# EAGLE design SparkFun_LIS3DH-Breakout (EAGLE 7.5.0)
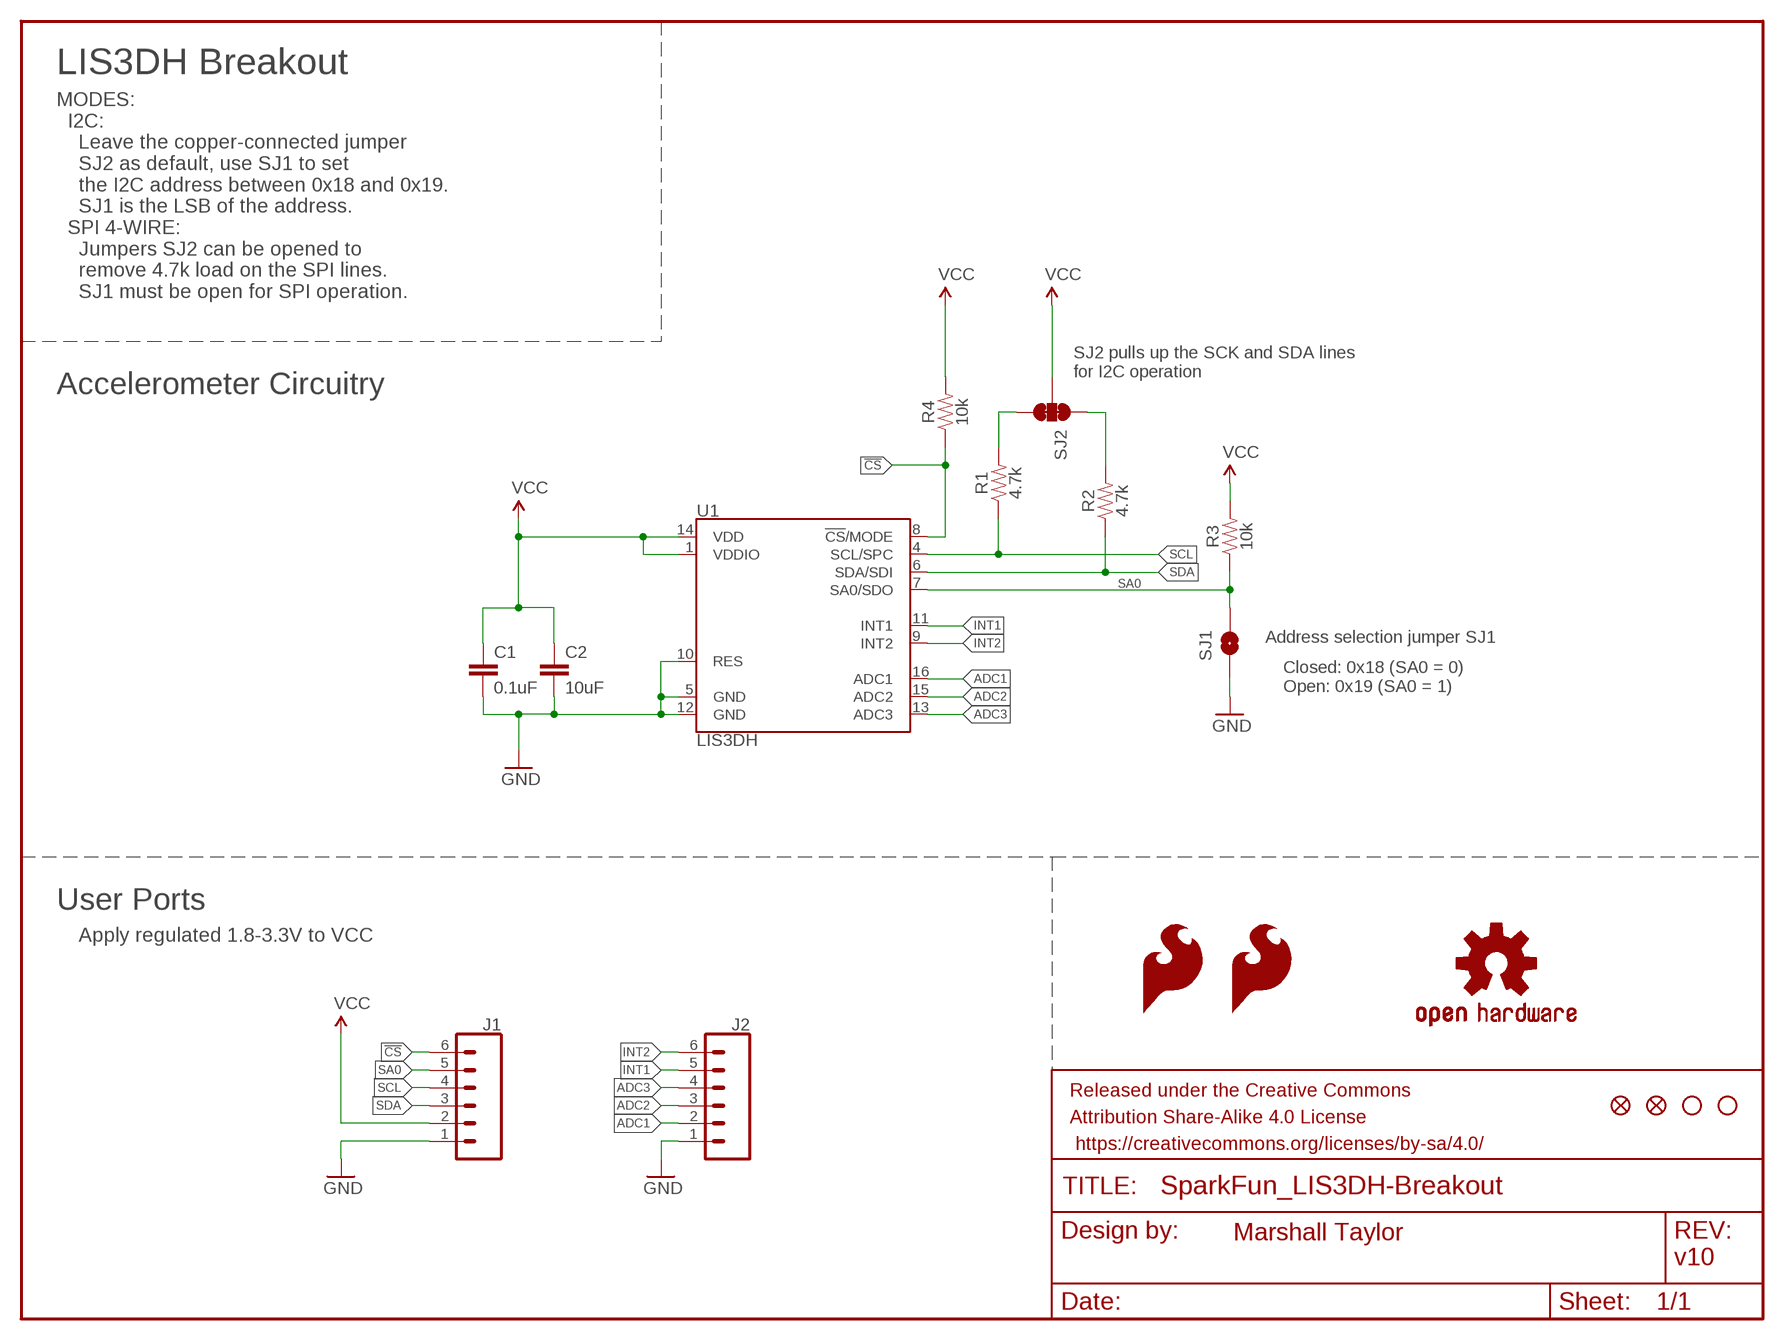
[diagram p0: schematic, sheet 1]

## Parts
C1  0.1uF  0.1UF-0402-16V-10%  [0402]
C2  10uF  10UF-0603-6.3V-20%  [0603]
FRAME2  FRAME-LETTER  [CREATIVE_COMMONS]
J1  CONN_06NO_SILK_FEMALE_PTH  [1X06_NO_SILK]
J2  CONN_06NO_SILK_FEMALE_PTH  [1X06_NO_SILK]
JP2  FIDUCIALUFIDUCIAL  [MICRO-FIDUCIAL]
JP3  STAND-OFF  [STAND-OFF]
JP4  STAND-OFF  [STAND-OFF]
JP6  FIDUCIALUFIDUCIAL  [MICRO-FIDUCIAL]
LOGO1  SFE_LOGO_FLAME.1_INCH  [SFE_LOGO_FLAME_.1]
LOGO2  SFE_LOGO_FLAME.1_INCH  [SFE_LOGO_FLAME_.1]
R1  4.7k  4.7KOHM-0603-1/10W-1%  [0603]
R2  4.7k  4.7KOHM-0603-1/10W-1%  [0603]
R3  10k  10KOHM-0603-1/10W-1%  [0603]
R4  10k  10KOHM-0603-1/10W-1%  [0603]
SJ1  SOLDERJUMPERNO  [SJ_2S-NO]
SJ2  JUMPER-PAD-3-NC_BY_TRACE  [PAD-JUMPER-3-3OF3_NC_BY_TRACE_YES_SILK_FULL_BOX]
U1  LIS3DH  [LGA-16-3X3]
U$1  OSHW-LOGOS  [OSHW-LOGO-S]

## Nets
!CS: J1.6 R4.1 U1.8(!CS!/MODE)
ADC1: J2.2 U1.16(ADC1)
ADC2: J2.3 U1.15(ADC2)
ADC3: J2.4 U1.13(ADC3)
GND: C1.2 C2.2 J1.1 J2.1 SJ1.1 U1.5(GND) U1.10(RES) U1.12(GND)
INT1: J2.5 U1.11(INT1)
INT2: J2.6 U1.9(INT2)
N$1: R2.2 SJ2.1
N$2: R1.2 SJ2.3
SA0: J1.5 R3.1 SJ1.2 U1.7(SA0/SDO)
SCL: J1.4 R1.1 U1.4(SCL/SPC)
SDA: J1.3 R2.1 U1.6(SDA/SDI)
VCC: C1.1 C2.1 J1.2 R3.2 R4.2 SJ2.2 U1.1(VDDIO) U1.14(VDD)

## Notes on the sheet
- LIS3DH Breakout
- MODES:
    I2C:
      Leave the copper-connected jumper
      SJ2 as default, use SJ1 to set
      the I2C address between 0x18 and 0x19.
      SJ1 is the LSB of the address.
    SPI 4-WIRE:
      Jumpers SJ2 can be opened to 
      remove 4.7k load on the SPI lines.
      SJ1 must be open for SPI operation.
- SJ2 pulls up the SCK and SDA lines
  for I2C operation
- Accelerometer Circuitry
- Address selection jumper SJ1
- Closed: 0x18 (SA0 = 0)
  Open: 0x19 (SA0 = 1)
- User Ports
- Apply regulated 1.8-3.3V to VCC
- Marshall Taylor
- v10

## Library data of the parts
C1 = SparkFun-Capacitors:0.1UF: 0.1µF ceramic capacitors A capacitor is a passive two-terminal electrical component used to store electrical energy temporarily in an electric field.; PROD_ID: CAP-12416
C2 = SparkFun-Capacitors:10UF: 10.0µF ceramic capacitors A capacitor is a passive two-terminal electrical component used to store electrical energy temporarily in an electric field.; PROD_ID: CAP-11015
FRAME2 = SparkFun-Aesthetics:FRAME-LETTER: Schematic Frame Standard 8.5x11 US Letter frame
J1 J2 = SparkFun-Connectors:CONN_06: Header 6 Standard 6-pin 0.1" header. Use with straight break away headers (SKU : PRT-00116), right angle break away headers (PRT-00553), swiss pins (PRT-00743), machine pins (PRT-00117), and female headers (PRT-00115). Molex polarized connector foot print use with SKU : PRT-08094 with associated crimp pins and housings. NOTES ON THE VARIANTS LOCK and LOCK_LONGPADS... This footprint was designed to help hold the alignment of a through-hole component (i.e. 6-pin header) while soldering it into place. You may notice that each hole has been shifted either up or down by 0.005 of an inch from it's more standard position (which is a perfectly straight line). This slight alteration caused the pins (the squares in the middle) to touch the edges of the holes. Because they are alternating, it causes a "brace" to hold the component in place. 0.005 has proven to be the perfect amount of "off-center" position when using our standard breakaway headers. Although looks a little odd when you look at the bare footprint, once you have a header in there, the alteration is very hard to notice. Also,if you push a header all the way into place, it is covered up entirely on the bottom side. This idea of altering the position of holes to aid alignment will be further integrated into the Sparkfun Library for other footprints. It can help hold any component with 3 or more connection pins.; PROD_ID: CONN-08437
JP2 JP6 = SparkFun:FIDUCIAL: Fiducial Alignment Points Various fiducial points for machine vision alignment.
JP3 JP4 = SparkFun:STAND-OFF: Stand Off This is the mechanical footprint for a #4 phillips button head screw. Use the keepout ring to avoid running the screw head into surrounding components. SKU : PRT-00447
LOGO1 LOGO2 = SparkFun-Aesthetics:SFE_LOGO_FLAME: SFE Logo, flame only This is the SparkFun flame logo. The logo on the schematic will always be the same size; the package variant is the height of the flame. Default layer for the logo on the board is tSilk.
R1 R2 = SparkFun-Resistors:4.7KOHM: 4.7kΩ resistor A resistor is a passive two-terminal electrical component that implements electrical resistance as a circuit element. Resistors act to reduce current flow, and, at the same time, act to lower voltage levels within circuits.; PROD_ID: RES-07857
R3 R4 = SparkFun-Resistors:10KOHM: 10kΩ resistor A resistor is a passive two-terminal electrical component that implements electrical resistance as a circuit element. Resistors act to reduce current flow, and, at the same time, act to lower voltage levels within circuits.; PROD_ID: RES-00824
SJ1 = SparkFun:SOLDERJUMPER: Solder Jumper Standard SMD solder jumper. Used to automate production. Two varients : Normally Open and Normally Closed are the same, but have different paste layers. NC will have a large amount of paste and should jumper during reflow.
SJ2 = TestAperatures:JUMPER-PAD-3-NC_BY_TRACE
U1 = SparkFun-Sensors:LIS3DH: ST Microelectronics LIS3DH 3-Axis ±2/4/8/16g SPI/I2C Accelerometer The LIS3DH is a three axis MEMS linear accelerometer in the "nano" family. It has a digital I2C/SPI serial interface which makes it ideal for using in embedded applications. The device also features ultra low-power operational modes that allow advanced power saving and smart sleep to wake-up functions, built in detections with interrupts, and auxiliary ADC inputs Datasheet-XXXX <http://www.sparkfun.com/datasheets/Sensors/Accelerometer/LIS3DH.pdf> SparkFun Products SparkFun Triple Axis Accelerometer Breakout - LIS3DH <https://www.sparkfun.com/products/10345> (SEN-XXXXX) Triple Axis Accelerometer - LIS3DH <https://www.sparkfun.com/products/9755> (SEN-XXXXX); PROD_ID: IC-13419; SF_ID: N/A
U$1 = SparkFun:OSHW-LOGO: Open Source Hardware Logo This logo indicates the piece of hardware it is found on incorporates a OSHW license and/or adheres to the definition of open source hardware found here: http://freedomdefined.org/OSHW

## Board
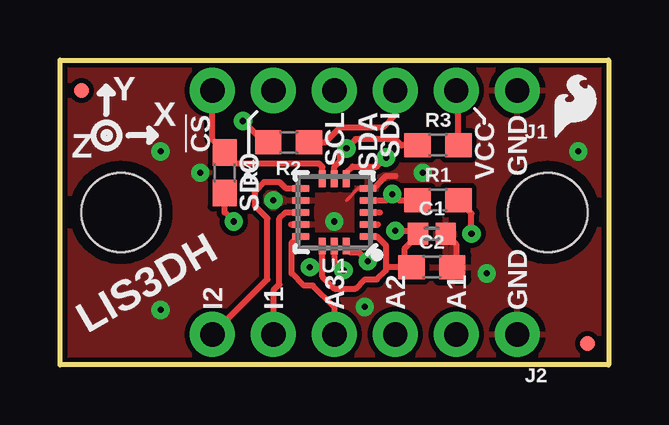
[diagram p1: board, top side]
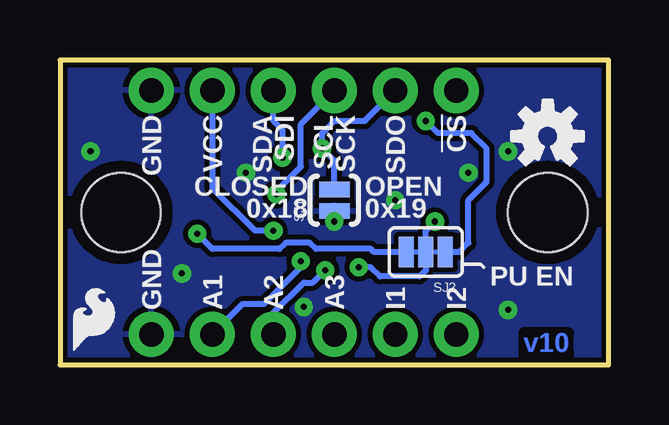
[diagram p2: board, bottom side, seen from below]

Size 22.86 x 12.7 mm. Coordinates in mm from the lower left corner, seen from the top.
Outline: 0,0 0,12.7 22.86,12.7 22.86,0 0,0
Copper layers (1*16): Top 0.035mm / dielectric 1.5mm / Bottom 0.035mm
Design rules "SparkFun-2-layer-FAB-LIMIT *": minimum track width 6mil, minimum drill 6mil, track to track 8mil, track to pad 8mil, pad to pad 8mil, via to via 8mil, smd to smd 4mil, copper to edge 8mil, drill to drill 8mil, minimum pad ring 12mil, minimum via ring 10mil, stop-mask expansion 4mil, vias tented up to drill 25mil, thermal gap 10mil

### Footprints (pad centres in the part's own frame; a part is rotated, then mirrored left to right if it is on the bottom)
0402 = smd 0.85 x 0.9: 1 -0.58,0; 2 0.58,0
0603 = smd 1.1 x 1: 1 -0.85,0; 2 0.85,0
1X06_NO_SILK = drill 1.016 pad 1.88: 1 0,0; 2 2.54,0; 3 5.08,0; 4 7.62,0; 5 10.16,0; 6 12.7,0
MICRO-FIDUCIAL = smd 0.635 x 0.635: 1 0,0
STAND-OFF = hole 3.302: 0,0
SJ_2S-NO = smd 0.635 x 1.27: 1 -0.45,0; 2 0.45,0
PAD-JUMPER-3-3OF3_NC_BY_TRACE_YES_SILK_FULL_BOX = smd 0.635 x 1.27: 1 -0.813,0; 2 0,0; 3 0.813,0
LGA-16-3X3 = smd 0.7 x 0.28: 1 -1.4,1; 2 -1.4,0.5; 3 -1.4,0; 4 -1.4,-0.5; 5 -1.4,-1; 9 1.4,-1; 10 1.4,-0.5; 11 1.4,0; 12 1.4,0.5; 13 1.4,1 | smd 0.28 x 0.7: 6 -0.5,-1.4; 7 0,-1.4; 8 0.5,-1.4; 14 0.5,1.4; 15 0,1.4; 16 -0.5,1.4

### Placement (x,y rotation side)
C1  15.49,5.46 0 top
C2  15.49,4.06 0 top
FRAME2  -20.32,-19.05 0 top  (outside the outline)
J1  19.05,11.43 180 top
J2  19.05,1.27 180 top
JP2  21.97,0.89 0 top
JP3  2.54,6.35 0 top
JP4  20.32,6.35 0 top
JP6  0.89,11.43 0 top
LOGO1  20.32,9.14 0 top
LOGO2  22.61,0.25 0 bottom
R1  15.75,6.86 0 top
R2  9.53,9.27 180 top
R3  15.75,9.14 0 top
R4  6.86,8 270 top
SJ1  11.43,6.86 90 bottom
SJ2  7.62,4.7 180 bottom
U1  11.43,6.35 180 top
U$1  2.54,9.53 0 bottom

### Tracks (layer width: path | path; a pad name or v marks a point on that pad's centre or on a via)
!CS
  Top 0.254: U1.8 10.93,8.25 10.79,8.38 7.33,8.38 R4.1 6.86,8.89 6.35,9.4 J1.6
ADC1  (via drill 0.25 pad 0.25)
  Top 0.254: U1.16 11.93,4.83 12.06,4.7 12.45,4.7 v12.83,4.32
  Bottom 0.254: v12.83,4.32 12.83,4.06 14.35,2.54 15.24,2.54 J2.2
ADC2  (via drill 0.25 pad 0.25)
  Top 0.254: U1.15 11.43,4.32 v11.81,3.94
  Bottom 0.254: v11.81,3.94 12.32,3.43 12.7,3.43 13.97,2.16 J2.3
ADC3
  Top 0.254: U1.13 9.92,5.35 9.65,5.08 9.65,3.81 10.16,3.3 10.54,3.3 11.43,2.41 J2.4
GND  (via drill 0.25 pad 0.25)
  Top 0.152: U1.5 12.43,7.35 11.94,6.86
  Top 0.254: v11.43,5.97 11.43,6.1 | 13.97,7.87 13.59,7.87 13.08,7.37 12.83,7.37 | C2.2 16.51,4.23 16.51,5.03 C1.2
  Bottom 0.254: SJ1.1 v11.43,5.97
  other vias: 17.78,3.81 12.7,2.41 8.89,6.86 5.84,8 4.19,2.29 15.11,8 21.59,8.89 4.19,8.89
  pour Bottom (isolate 0.203): 0,0 0,12.7 22.86,12.7 22.86,0
  pour Top (isolate 0.203): 0,0 0,12.7 22.86,12.7 22.86,0
INT1
  Top 0.254: U1.11 9.4,6.35 9.14,6.1 9.14,3.35 8.89,3.1 J2.5
INT2
  Top 0.254: U1.9 10.01,7.37 9.4,7.37 9.14,7.62 8.51,7.62 8.13,7.24 8.13,6.6 8.64,6.1 8.64,3.56 J2.6
N$1  (via drill 0.25 pad 0.25)
  Top 0.254: R2.2 8.51,9.27 v7.62,10.16
  Bottom 0.254: v7.62,10.16 7.11,9.65 5.71,9.65 5.08,9.02 5.08,7.62 5.84,6.86 5.84,5.08 6.22,4.7 SJ2.1
N$2  (via drill 0.25 pad 0.25)
  Top 0.254: v17.14,5.46 17.14,6.31 R1.2
  Bottom 0.254: SJ2.3 9.78,4.7 9.91,4.83 12.19,4.83 12.45,5.08 13.46,5.08 13.72,4.83 16.51,4.83 v17.14,5.46
N$4
  Top 0.254: 13.08,6.35 13.34,6.35
N$5
  Top 0.254: 13.08,5.84 13.26,5.84
N$6
  Top 0.254: 9.63,5.84 9.88,5.84
SA0  (via drill 0.25 pad 0.25)
  Top 0.254: U1.7 11.43,8.26 11.68,8.51 11.68,8.76 v11.94,9.02 12.32,9.4 13.97,9.4 14.22,9.14 R3.1
  Bottom 0.254: J1.5 10.16,10.16 11.43,10.16 11.94,9.65 v11.94,9.02 11.43,8.51 SJ1.2
SCL  (via drill 0.25 pad 0.25)
  Top 0.254: U1.4 13.58,6.85 v13.84,7.11 14.1,6.86 R1.1
  Bottom 0.254: J1.4 12.83,10.03 12.83,8.26 13.84,7.24 v13.84,7.11
SDA  (via drill 0.25 pad 0.25)
  Top 0.254: U1.6 11.93,7.99 12.19,8.26 13.21,8.26 v13.59,8.64 | R2.1 11.05,9.27 11.68,9.91 13.46,9.91 13.97,10.41 J1.3
  Bottom 0.254: v13.59,8.64 13.59,9.78 13.97,10.16 J1.3
VCC  (via drill 0.25 pad 0.25)
  Top 0.254: 16.51,9.23 R3.2 16.6,11.34 J1.2 | 10.93,3.94 10.93,3.67 11.43,3.17 12.32,3.17 12.7,3.56 13.21,3.56 13.59,3.94 13.59,4.06 | 10.93,3.94 U1.14 | v10.41,4.06 10.8,4.06 10.93,3.94 | 13.59,4.06 C2.1 14.35,4.36 14.35,4.83 14.91,5.39 C1.1 14.79,5.59 v13.97,5.59 | 13.59,4.06 13.59,4.95 13.19,5.35 U1.1 | v7.24,5.97 6.86,6.35 R4.2
  Bottom 0.254: v7.24,5.97 7.62,5.59 SJ2.2 7.62,3.94 7.87,3.68 9.53,3.68 9.91,4.06 v10.41,4.06 | J1.2 16.51,7.37 14.73,5.59 v13.97,5.59

### Text on the board
Bottom: v10
tPlace: Y | SCL | SDA / SDI | X | !CS | VCC | GND | Z | SDO | I2 | I1 | A3 | A2 | A1 | GND | LIS3DH
bPlace: !CS | SDO | SCL / SCK | SDA / SDI | VCC | GND | OPEN / 0x19 | CLOSED / 0x18 | PU EN | I2 | I1 | A3 | A2 | A1 | GND
tDocu: Marshall Taylor